# Altium schematic sheet Pushbuttons.SchDoc: Nyomógombok
size A4; Author: Debreczeni László; Organization: BME-AUT; DocumentNumber: 5; Revision: A27; SheetNumber: 5; SheetTotal: 5
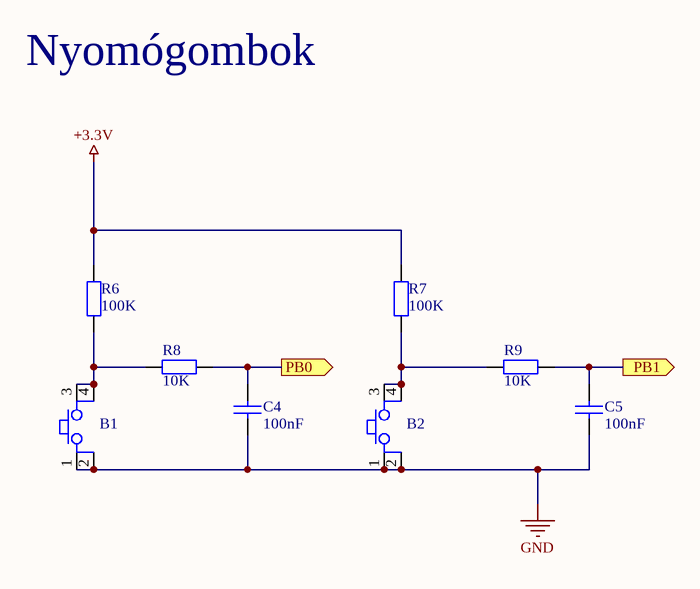
[diagram p0: Pushbuttons.SchDoc]

## Parts
B1  Button  [FP_BTN_SMD]  (value not drawn)
B2  Button  [FP_BTN_SMD]  (value not drawn)
C4  100nF  [FP_1206_CAP_125]
C5  100nF  [FP_1206_CAP_125]
R6  100K  [FP_1206_RES]
R7  100K  [FP_1206_RES]
R8  10K  [FP_1206_RES]
R9  10K  [FP_1206_RES]

## Ports
PB0 (out), PB1 (out)

## Nets
+3.3V: R6.2 R7.2
GND: B1.1 B1.2 B2.1 B2.2 C4.1 C5.1
PB0: C4.2 R8.2 ; port PB0
PB1: C5.2 R9.2 ; port PB1
NetB1_3: B1.3 B1.4 R6.1 R8.1
NetB2_3: B2.3 B2.4 R7.1 R9.1

## Notes on the sheet
- Nyomógombok
- Title
- Size:
- Date:
- A4
- Number:
- Time:
- Revision:
- Sheet
- of
- File:

## Library data of the parts
B1 B2 = Button 4P: Push button; Name: 4P Pushbutton; Reference: 45-05-43; Supplier: Lomex
C4 C5 = CAP: Capacitor; Tolerance: 10%; Voltage: 50V; Name: 100nF 1206 Capacitor; Supplier: Lomex; Reference: 82-14-64; Value: 100nF
R6 R7 = RES: Resistor; Tolerance: 5%; Power: 0.25W; Name: 100K 1206 resistor; Supplier: Lomex; Reference: 81-11-71; Value: 100K
R8 R9 = RES: Resistor; Tolerance: 5%; Power: 0.25W; Name: 10K 1206 Resistor; Supplier: Lomex; Reference: 81-11-59; Value: 10K